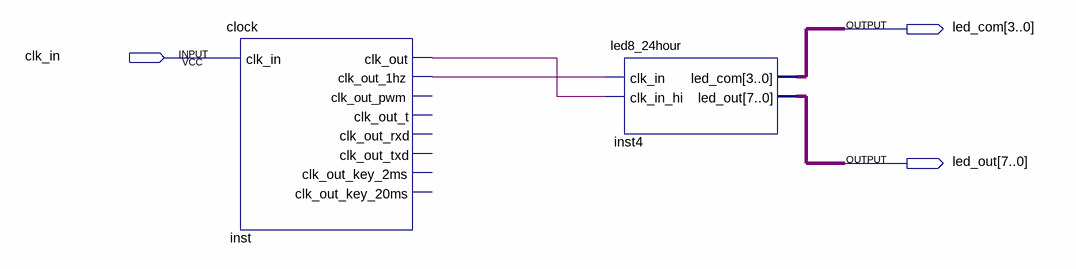
[diagram p0: schematic sheet]
// Quartus schematic led8_24hour_bdf.bdf as structural Verilog: 2 symbols, 3 pins
module led8_24hour_bdf (
  input  clk_in,
  output [3:0] led_com,
  output [7:0] led_out
);

  wire inst_clk_out, inst_clk_out_1hz;

  clock inst (
    .clk_in(clk_in), .clk_out(inst_clk_out), .clk_out_1hz(inst_clk_out_1hz));  // open: clk_out_pwm, clk_out_t, clk_out_rxd, clk_out_txd, clk_out_key_2ms, clk_out_key_20ms
  led8_24hour inst4 (.clk_in(inst_clk_out_1hz), .clk_in_hi(inst_clk_out), .led_com(led_com), .led_out(led_out));
endmodule
